# EAGLE design USBSerial (EAGLE 6.3)
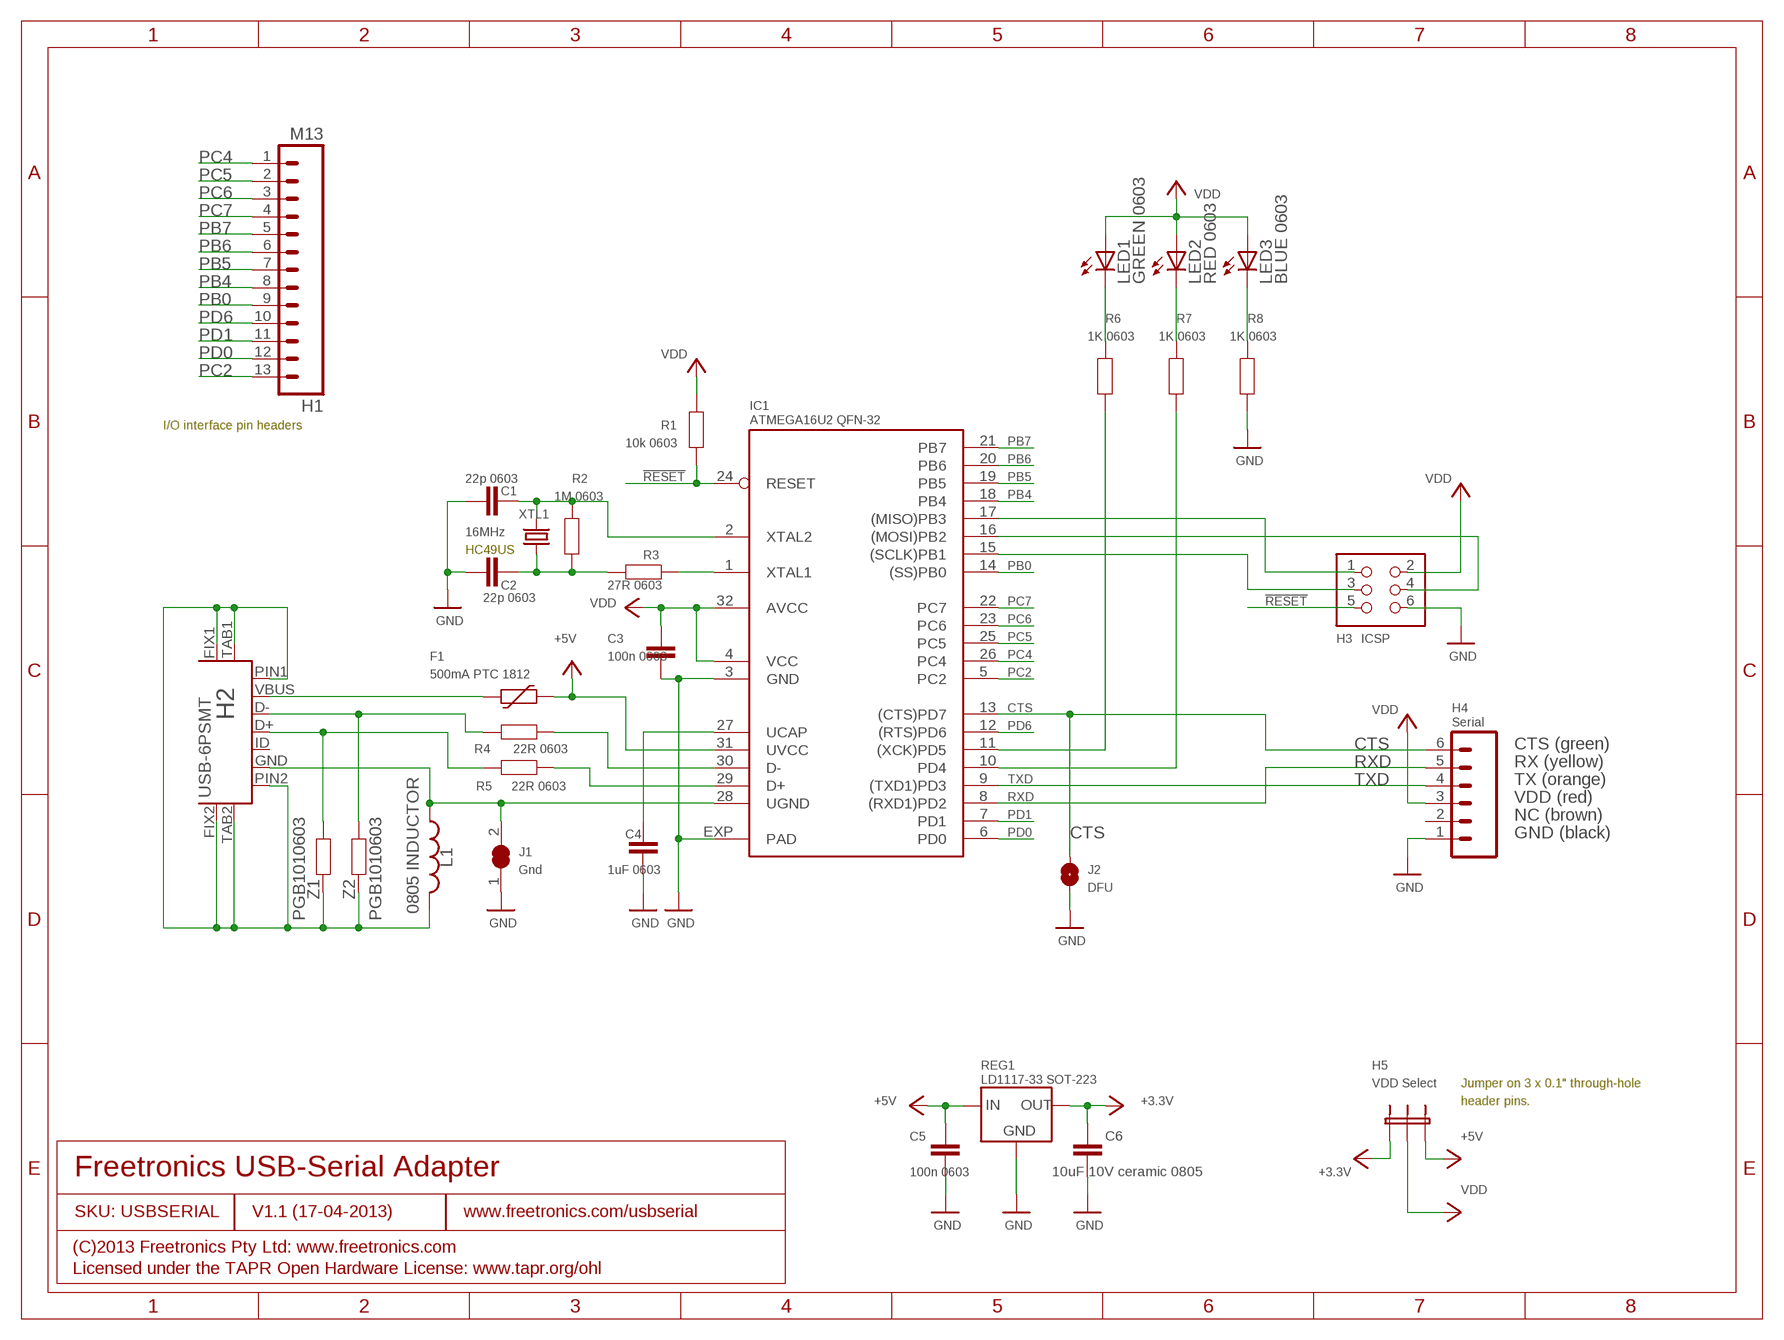
[diagram p0: schematic, sheet 1]

## Parts
C1  22p 0603  CAP0603  [0603]
C2  22p 0603  CAP0603  [0603]
C3  100n 0603  CAP0603  [0603]
C4  1uF 0603  CAP0603  [0603]
C5  100n 0603  CAP0603  [0603]
C6  10uF 10V ceramic 0805  C-EUC0805  [C0805]
F1  500mA PTC 1812  PTC  [1812]
H1  M13  [1X13]
H2  USB-6PSMT  [USB-MICROB-MB05PMXX]
H3  ICSP  HEADER_2X3  [HEADER_2X3]
H4  Serial  M06SIP  [1X06]
H5  VDD Select  JUMPER_SPDT  [JUMPER_SPDT]
IC1  ATMEGA16U2 QFN-32  ATMEL_ATMEGA8U2-MUQFN  [ATMEL_QFN32]
J1  Gnd  SJCN  [SJC]
J2  DFU  SJ  [SJ]
L1  0805 INDUCTOR  INDUCTOR0805-LARGE  [0805-LARGE]
LED1  GREEN 0603  LED0603  [LED-0603]
LED2  RED 0603  LED0603  [LED-0603]
LED3  BLUE 0603  LED0603  [LED-0603]
R1  10k 0603  RESISTOR0603  [0603]
R2  1M 0603  RESISTOR0603  [0603]
R3  27R 0603  RESISTOR0603  [0603]
R4  22R 0603  RESISTOR0603  [0603]
R5  22R 0603  RESISTOR0603  [0603]
R6  1K 0603  RESISTOR0603  [0603]
R7  1K 0603  RESISTOR0603  [0603]
R8  1K 0603  RESISTOR0603  [0603]
REG1  LD1117-33 SOT-223  LD1117-FIXED  [SOT-223]
XTL1  16MHz  CRYSTALHC49US  [HC49US]
Z1  PGB1010603  RESISTOR0603  [0603]
Z2  PGB1010603  RESISTOR0603  [0603]

## Nets
!RESET: H3.5 IC1.24(RESET) R1.1
+3V3: C6.1 H5.1 REG1.2(OUT) REG1.4(OUT) ; supply symbol labelled +3.3V
+5V: C5.1 F1.2 H5.3 IC1.31(UVCC) REG1.3(IN)
CTS: H4.6 IC1.13((CTS)PD7) J2.2
GND: C1.1 C2.1 C3.2 C4.2 C5.2 C6.2 H3.6 H4.1 IC1.3(GND) IC1.EXP(PAD) J1.1 J2.1 R8.1 REG1.1(GND)
MISO: H3.1 IC1.17((MISO)PB3)
MOSI: H3.4 IC1.16((MOSI)PB2)
N$1: H2.GND IC1.28(UGND) J1.2 L1.1
N$2: IC1.1(XTAL1) R3.1
N$3: LED1.C R6.2
N$7: LED2.C R7.2
N$8: H2.FIX1 H2.FIX2 H2.PIN1 H2.PIN2 H2.TAB1 H2.TAB2 L1.2 Z1.2 Z2.2
N$9: LED3.C R8.2
N$16: H2.D+ R5.2 Z1.1
N$17: H2.D- R4.2 Z2.1
N$113: C1.2 IC1.2(XTAL2) R2.2 XTL1.2
N$114: C2.2 R2.1 R3.2 XTL1.1
N$115: F1.1 H2.VBUS
N$117: C4.1 IC1.27(UCAP)
PB0: H1.9 IC1.14((SS)PB0)
PB4: H1.8 IC1.18(PB4)
PB5: H1.7 IC1.19(PB5)
PB6: H1.6 IC1.20(PB6)
PB7: H1.5 IC1.21(PB7)
PC2: H1.13 IC1.5(PC2)
PC4: H1.1 IC1.26(PC4)
PC5: H1.2 IC1.25(PC5)
PC6: H1.3 IC1.23(PC6)
PC7: H1.4 IC1.22(PC7)
PD0: H1.12 IC1.6(PD0)
PD1: H1.11 IC1.7(PD1)
PD6: H1.10 IC1.12((RTS)PD6)
RD+: IC1.29(D+) R5.1
RD-: IC1.30(D-) R4.1
RXD: H4.5 IC1.8((RXD1)PD2)
RXLED: IC1.10(PD4) R7.1
SCK: H3.3 IC1.15((SCLK)PB1)
TXD: H4.4 IC1.9((TXD1)PD3)
TXLED: IC1.11((XCK)PD5) R6.1
VDD: C3.1 H3.2 H4.3 H5.2 IC1.4(VCC) IC1.32(AVCC) LED1.A LED2.A LED3.A R1.2
Unconnected: H2.ID H4.2

## Notes on the sheet
- I/O interface pin headers
- HC49US
- CTS (green)
- RX (yellow)
- TX (orange)
- VDD (red)
- NC (brown)
- GND (black)
- Jumper on 3 x 0.1" through-hole
- header pins.
- Freetronics USB-Serial Adapter
- SKU: USBSERIAL | V1.1 (17-04-2013) | www.freetronics.com/usbserial
- (C)2013 Freetronics Pty Ltd: www.freetronics.com
- Licensed under the TAPR Open Hardware License: www.tapr.org/ohl

## Library data of the parts
C1-C5 = freetronics:CAP: Capacitor Standard 0603 ceramic capacitor, and 0.1" leaded capacitor.
C6 = freetronics-jon:C-EU: CAPACITOR, European symbol
F1 = freetronics-luke:PTC: Polymeric PTC ("Polyfuse")
H1 = freetronics-jon:M13
H2 = freetronics-jon:USB-6P
H3 = freetronics-luke:HEADER_2X3: 6-pin (2x3) 0.1" male through-hole pin header.
H4 = freetronics-master-v1:M06: Header 6 Standard 6-pin 0.1" header. Use with straight break away headers (SKU : PRT-00116), right angle break away headers (PRT-00553), swiss pins (PRT-00743), machine pins (PRT-00117), and female headers (PRT-00115). Molex polarized connector foot print use with SKU : PRT-08094 with associated crimp pins and housings. NOTES ON THE VARIANTS LOCK and LOCK_LONGPADS... This footprint was designed to help hold the alignment of a through-hole component (i.e. 6-pin header) while soldering it into place. You may notice that each hole has been shifted either up or down by 0.005 of an inch from it's more standard position (which is a perfectly straight line). This slight alteration caused the pins (the squares in the middle) to touch the edges of the holes. Because they are alternating, it causes a "brace" to hold the component in place. 0.005 has proven to be the perfect amount of "off-center" position when using our standard breakaway headers. Although looks a little odd when you look at the bare footprint, once you have a header in there, the alteration is very hard to notice. Also, if you push a header all the way into place, it is covered up entirely on the bottom side. This idea of altering the position of holes to aid alignment will be further integrated into the Sparkfun Library for other footprints. It can help hold any component with 3 or more connection pins.
H5 = freetronics-luke:JUMPER_SPDT: 3-pin (SPDT) jumper header, 0.1" pitch through-hole.
IC1 = freetronics-jon:ATMEL_ATMEGA8U2-MU
J1 = freetronics-jon:SJC
J2 = freetronics-luke:SJ: PCB "solder jumper". Note that there should nothing on the BOM corresponding to this "component".
L1 = freetronics-master-v1:INDUCTOR: Inductors Basic Inductor/Choke - 0603 and 1206. Footprints are not proven and vary greatly between part numbers.
LED1-LED3 = freetronics-jon:LED: LEDs Standard schematic elements and footprints for 5mm, 3mm, 1206, and 0603 sized LEDs. 5mm - Spark Fun Electronics SKU : COM-00529 (and others)
R1-R8 Z1 Z2 = freetronics:RESISTOR: Resistor Basic schematic elements and footprints for 0603, 1206, and PTH 1/10th watt (small) resistors.
REG1 = freetronics-luke:LD1117-FIXED: Fixed-voltage LD1117 series LDOs in SOT-223 package. Note that the ground pin is labelled as ground, not as adj, because it's not the adjustable-voltage part.
XTL1 = freetronics-master-v1:CRYSTAL: Crystals Various standard crystals. Proven footprints. Spark Fun Electronics SKU : COM-00534

## Net classes
0 default: width 0.152 mm, drill 0.241 mm, clearance 0.152 mm

## Board
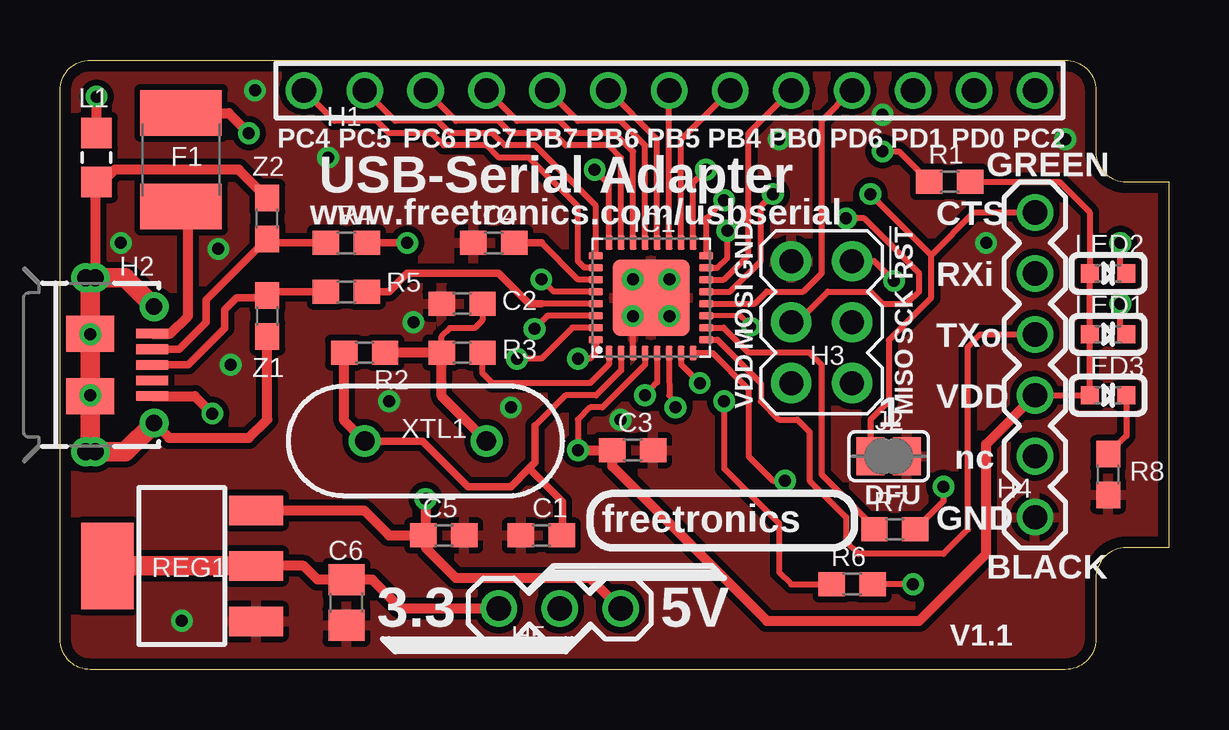
[diagram p1: board, top side]
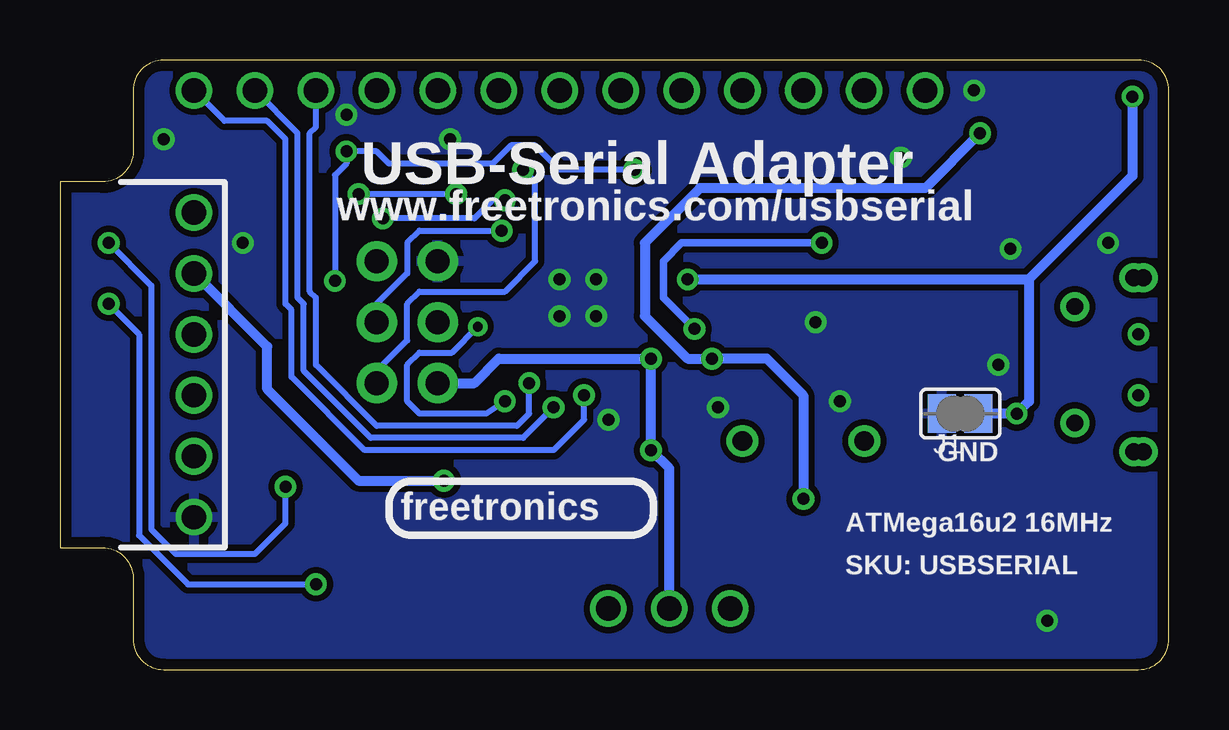
[diagram p2: board, bottom side, seen from below]

Size 46.23 x 25.4 mm. Coordinates in mm from the lower left corner, seen from the top.
Outline: 0,24.13 arc-90 1.27,25.4 41.91,25.4 arc-90 43.18,24.13 43.18,21.59 arc90 44.45,20.32 46.23,20.32 46.23,5.08 44.45,5.08 arc90 43.18,3.81 43.18,1.27 arc-90 41.91,0 1.27,0 arc-90 0,1.27 0,24.13
Copper layers (1*16): Top 0.035mm / dielectric 1.5mm / Bottom 0.035mm
Design rules "default": minimum track width 8mil, minimum drill 15mil, track to track 10mil, track to pad 10mil, pad to pad 10mil, via to via 10mil, smd to smd 8mil, copper to edge 18mil, drill to drill 8mil, minimum pad ring 10mil, minimum via ring 8mil, stop-mask expansion 4mil, vias tented up to drill 25mil, thermal gap 10mil

### Footprints (pad centres in the part's own frame; a part is rotated, then mirrored left to right if it is on the bottom)
0603 = smd 1.1 x 1: 1 -0.85,0; 2 0.85,0
C0805 = smd 1.3 x 1.5: 1 -0.95,0; 2 0.95,0
1812 = smd 1.9 x 3.4: 1 -1.95,0; 2 1.95,0
1X13 = drill 1.016: 1 0,0; 2 2.54,0; 3 5.08,0; 4 7.62,0; 5 10.16,0; 6 12.7,0; 7 15.24,0; 8 17.78,0; 9 20.32,0; 10 22.86,0; 11 25.4,0; 12 27.94,0; 13 30.48,0
USB-MICROB-MB05PMXX = smd 0.4 x 1.35: D+ 0,2.575; D- -0.65,2.575; GND 1.3,2.575; ID 0.65,2.575; VBUS -1.3,2.575 | smd 1.5 x 2: FIX1 -1.3,0; FIX2 1.3,0 | drill 0.7: PIN1 -2.425,2.65; PIN2 2.425,2.65; SLOT1 -3.625,-0.2; SLOT2 3.625,-0.2; TAB1 -3.625,0.2; TAB2 3.625,0.2
HEADER_2X3 = drill 1 pad 1.676: 1 -2.54,-1.27; 2 -2.54,1.27; 3 0,-1.27; 4 0,1.27; 5 2.54,-1.27; 6 2.54,1.27
1X06 = drill 1.016: 1 0,0; 2 2.54,0; 3 5.08,0; 4 7.62,0; 5 10.16,0; 6 12.7,0
JUMPER_SPDT = drill 1.016: 1 -2.54,0; 2 0,0; 3 2.54,0
ATMEL_QFN32 = smd 0.6 x 0.3: 1 -2.3,1.75; 2 -2.3,1.25; 3 -2.3,0.75; 4 -2.3,0.25; 5 -2.3,-0.25; 6 -2.3,-0.75; 7 -2.3,-1.25; 8 -2.3,-1.75; 17 2.3,-1.75; 18 2.3,-1.25; 19 2.3,-0.75; 20 2.3,-0.25; 21 2.3,0.25; 22 2.3,0.75; 23 2.3,1.25; 24 2.3,1.75 | smd 0.3 x 0.6: 9 -1.75,-2.3; 10 -1.25,-2.3; 11 -0.75,-2.3; 12 -0.25,-2.3; 13 0.25,-2.3; 14 0.75,-2.3; 15 1.25,-2.3; 16 1.75,-2.3; 25 1.75,2.3; 26 1.25,2.3; 27 0.75,2.3; 28 0.25,2.3; 29 -0.25,2.3; 30 -0.75,2.3; 31 -1.25,2.3; 32 -1.75,2.3 | smd 3.2 x 3.2: EXP 0,0
SJC = smd 1.168 x 1.6: 1 -0.762,0; 2 0.762,0
SJ = smd 1.168 x 1.6: 1 -0.762,0; 2 0.762,0
0805-LARGE = smd 1.27 x 1.27: 1 -1.016,0; 2 1.016,0
LED-0603 = smd 0.762 x 0.762: A -0.762,0; C 0.762,0
SOT-223 = smd 1.219 x 2.235: 1 -2.311,-3.099; 2 0,-3.099; 3 2.311,-3.099 | smd 3.6 x 2.2: 4 0,3.099
HC49US = drill 0.813: 1 -2.54,0; 2 2.54,0

### Placement (x,y rotation side)
C1  20.07,5.59 0 top
C2  16.76,15.24 0 top
C3  23.88,9.14 0 top
C4  18.08,17.78 180 top
C5  16,5.59 0 top
C6  11.94,2.79 270 top
F1  5.05,21.24 90 top
H1  10.16,24.13 0 top
H2  1.27,12.7 270 top
H3  31.75,14.48 90 top
H4  40.64,6.35 90 top
H5  20.83,2.54 0 top
IC1  24.64,15.49 90 top
J1  8.7,10.67 0 bottom
J2  34.54,8.89 180 top
L1  1.52,21.34 270 top
LED1  43.69,13.97 0 top
LED2  43.69,16.51 0 top
LED3  43.69,11.43 0 top
R1  37.08,20.32 0 top
R2  12.7,13.21 180 top
R3  16.76,13.21 180 top
R4  11.94,17.78 180 top
R5  11.94,15.75 180 top
R6  33.02,3.56 0 top
R7  34.8,5.84 0 top
R8  43.69,8.13 90 top
REG1  5.08,4.32 90 top
XTL1  15.24,9.53 180 top
Z1  8.64,14.73 270 top
Z2  8.64,18.8 90 top

### Tracks (layer width: path | path; a pad name or v marks a point on that pad's centre or on a via)
!RESET  (via drill 0.5)
  Top 0.254: 36.52,20.48 R1.1 34.96,21.59 v34.29,21.59 | IC1.24 22.89,20.23 v22.29,20.83 | H3.5 33.94,17.02 v34.77,16.19
  Top 0.406: 36.35,20.48 36.52,20.48
  Bottom 0.254: v34.77,16.19 34.77,20.61 34.29,21.08 v34.29,21.59 33.02,21.59 32.51,21.08 28.19,21.08 27.43,21.84 26.42,21.84 25.4,20.83 v22.29,20.83
+3V3
  Top 0.406: REG1.2 10.16,4.32 10.73,3.74 C6.1 13.02,3.74 14.22,2.54 H5.1
  Top 0.813: REG1.2 REG1.4
+5V  (via drill 0.5)
  Top 0.254: IC1.31 21.36,14.24 20.07,12.95 v19.05,12.95
  Top 0.406: REG1.3 12.68,6.63 13.72,5.59 C5.1 | v15.24,7.11 15.24,5.68 15.24,5.08 16.51,3.81 22.1,3.81 H5.3 | F1.2 7.04,23.19 v7.87,22.35
  Top 0.61: 15.24,5.68 C5.1
  Bottom 0.406: v15.24,7.11 15.24,11.43 16.76,12.95 v19.05,12.95 20.07,12.95 21.84,14.73 21.84,17.78 19.56,20.07 10.16,20.07 v7.87,22.35
CTS  (via drill 0.5)
  Top 0.254: IC1.13 27.94,15.74 29.21,17.02 29.21,19.3 v29.72,19.81 | 36.32,17.27 36.32,15.49 34.54,13.72 34.54,11.18 33.78,10.41 J2.2 | 36.32,17.27 v33.78,19.81 | 36.32,17.27 38.1,19.05 H4.6
  Bottom 0.254: v29.72,19.81 v33.78,19.81
GND  (via drill 0.5)
  Top 0.254: 23.89,14.2 24.13,14.45 23.97,14.61 | IC1.3 23.89,14.52 23.97,14.61 | 23.97,14.61 23.97,14.73 | 23.97,14.73 23.97,14.83 | v23.88,14.73 23.97,14.73
  Top 0.406: 23.97,14.83 IC1.EXP
  other vias: 8.13,24.13 41.91,22.1 14.73,14.48 5.08,2.03 18.8,10.92 13.72,11.18 25.4,16.26 23.88,16.26 25.4,14.73 29.97,22.1 11.18,21.34 34.29,23.11 23.37,10.41 38.61,17.78 2.54,17.78 6.6,17.53 7.11,12.7
  pour Bottom: 0,25.4 43.18,25.4 43.18,21.59 arc90 44.45,20.32 46.23,20.32 46.23,5.08 44.45,5.08 arc90 43.18,3.81 43.18,0 0,0
  pour Top: 0,25.4 43.18,25.4 43.18,21.59 arc90 44.45,20.32 46.23,20.32 46.23,5.08 44.45,5.08 arc90 43.18,3.81 43.18,0 0,0
MISO  (via drill 0.5)
  Top 0.254: IC1.17 26.39,20.29 v26.92,20.83
  Bottom 0.254: H3.1 33.02,12.45 31.75,13.72 31.75,15.24 31.24,15.75 27.69,15.75 26.42,17.02 26.42,20.32 v26.92,20.83
MOSI  (via drill 0.5)
  Top 0.254: IC1.16 26.94,18.81 v27.69,19.56 | H3.4 30.73,14.48 32,15.75 33.78,15.75 34.29,15.24 35.31,15.24 35.81,15.75 35.81,16.51 33.53,18.8 v32.77,18.8
  Bottom 0.254: v27.69,19.56 28.19,19.56 28.96,18.8 v32.77,18.8
N$1  (via drill 0.5)
  Top 0.254: IC1.28 20.58,15.74 v20.07,16.26
  Top 0.406: H2.GND 5.62,11.4 v6.35,10.67 | L1.1 v1.52,23.88
  Bottom 0.406: v1.52,23.88 1.52,20.57 5.84,16.26 | 5.84,16.26 5.84,11.18 v6.35,10.67 J1.2 | v20.07,16.26 5.84,16.26
N$2
  Top 0.254: IC1.1 22.89,12.73 22.1,11.94 18.03,11.94 17.61,12.36 R3.1
N$3  (via drill 0.5)
  Top 0.254: LED1.C 44.2,14.22 v44.2,15.24 | v35.56,3.56 R6.2
  Bottom 0.254: v44.2,15.24 42.93,13.97 42.93,5.59 40.89,3.56 v35.56,3.56
N$7  (via drill 0.5)
  Top 0.254: LED2.C 44.2,16.76 v44.2,17.78 | 35.9,5.93 R7.2 36.83,7.02 v36.83,7.62
  Bottom 0.254: v44.2,17.78 42.42,16 42.42,5.84 41.4,4.83 38.1,4.83 36.83,6.1 v36.83,7.62
N$8  (via drill 0.5)
  Top 0.406: 1.52,16.38 H2.TAB1 1.47,20.27 L1.2 1.78,20.32 2.29,20.83 7.45,20.83 Z2.2 | H2.PIN2 4.54,9.65 7.87,9.65 8.64,10.41 Z1.2
  Top 0.813: H2.PIN1 2.72,16.32 H2.TAB1 1.27,16.12 H2.FIX1 v1.27,13.97 v1.27,11.43 H2.FIX2 1.27,9.28 H2.TAB2 2.72,9.07 H2.PIN2
N$9
  Top 0.254: LED3.C 44.45,9.74 R8.2
N$16
  Top 0.305: H2.D+ 5.33,12.7 6.86,14.22 6.86,14.99 7.37,15.49 8.55,15.49 Z1.1 8.8,15.75 R5.2
N$17
  Top 0.305: H2.D- 4.97,13.35 6.1,14.48 6.1,15.41 Z2.1 8.8,17.78 R4.2
N$113
  Top 0.254: 20.95,5.77 C1.2 | IC1.2 23.39,12.47 22.35,11.43 21.08,11.43 19.81,10.16
  Top 0.305: XTL1.2 15.11,9.53 17.02,7.62 18.8,7.62 19.56,8.38 | 19.56,8.38 19.81,8.64 19.81,10.16 | 20.95,5.77 20.95,6.99 19.56,8.38
  Top 0.406: 20.95,5.56 20.95,5.77 | XTL1.2 11.85,10.38 R2.2
N$114
  Top 0.254: R3.2 15.91,13.88 16.26,14.22 17.27,14.22 17.61,14.57 C2.2
  Top 0.406: XTL1.1 15.91,11.39 R3.2 R2.1
N$115
  Top 0.406: H2.VBUS 4.6,14 5.33,14.73 5.33,19 F1.1
N$117
  Top 0.254: IC1.27 21.6,16.24 20.07,17.78
  Top 0.305: 20.07,17.78 C4.1
PB0
  Top 0.254: IC1.14 27.67,16.24 28.7,17.27 28.7,22.35 H1.9
PB4
  Top 0.254: IC1.18 25.89,22.08 H1.8
PB5
  Top 0.254: IC1.19 25.39,24.12 H1.7
PB6
  Top 0.254: IC1.20 24.89,22.1 H1.6
PB7
  Top 0.254: IC1.21 24.39,21.84 23.37,22.86 21.59,22.86 H1.5
PC2  (via drill 0.5)
  Top 0.254: IC1.5 24.89,11.97 v24.38,11.43
  Bottom 0.254: v24.38,11.43 24.38,10.41 25.65,9.14 33.53,9.14 36.58,12.19 36.58,14.99 36.83,15.24 36.83,22.1 37.59,22.86 39.37,22.86 H1.13
PC4
  Top 0.254: IC1.26 21.86,16.74 21.59,17.02 21.59,19.3 19.56,21.34 18.29,21.34 17.78,21.84 16,21.84 15.49,22.35 13.72,22.35 13.21,22.86 11.43,22.86 H1.1
PC5
  Top 0.254: IC1.25 22.34,19.32 19.81,21.84 18.54,21.84 18.03,22.35 16.26,22.35 15.75,22.86 13.97,22.86 H1.2
PC6
  Top 0.254: IC1.23 23.39,21.32 22.86,21.84 21.08,21.84 20.57,22.35 18.8,22.35 18.29,22.86 16.51,22.86 H1.3
PC7
  Top 0.254: IC1.22 23.89,21.58 23.11,22.35 21.34,22.35 20.83,22.86 19.05,22.86 H1.4
PD0  (via drill 0.5)
  Top 0.254: IC1.6 25.39,12.43 25.4,11.43 v25.65,10.92
  Bottom 0.254: v25.65,10.92 26.92,9.65 33.27,9.65 36.07,12.45 36.07,15.24 36.32,15.49 36.32,22.35 H1.12
PD1  (via drill 0.5)
  Top 0.254: IC1.7 25.89,12.72 v26.67,11.94
  Bottom 0.254: v26.67,11.94 26.67,10.67 27.18,10.16 33.02,10.16 35.56,12.7 35.56,15.49 35.81,15.75 35.81,22.35 35.56,22.61 H1.11
PD6
  Top 0.254: IC1.12 28.96,15.24 29.46,15.75 30.99,15.75 31.75,16.51 31.75,22.86 H1.10
RD+
  Top 0.254: IC1.29 20.06,15.24
  Top 0.305: R5.1 13.72,15.75 14.48,16.51 18.29,16.51 19.55,15.24 20.06,15.24 20.07,15.24
RD-  (via drill 0.5)
  Top 0.254: IC1.30 20.33,14.74 v19.78,14.19
  Top 0.305: R4.1 v14.48,17.78
  Bottom 0.305: v14.48,17.78 20.32,17.78 21.08,17.02 21.08,15.49 v19.78,14.19
RXD  (via drill 0.5)
  Top 0.254: IC1.8 27.19,13.19 28.7,11.68 28.7,8.89 29.72,7.87 v30.23,7.87
  Bottom 0.406: v30.23,7.87 33.78,7.87 37.59,11.68 37.59,13.46 H4.5
RXLED
  Top 0.254: IC1.10 27.67,14.24 28.7,13.21 31.24,13.21 31.75,12.7 31.75,8.13 34.04,5.84 R7.1
SCK  (via drill 0.5)
  Top 0.254: IC1.15 27.41,16.74 27.81,17.14 v27.81,18.29
  Bottom 0.254: H3.3 33.02,15.24 31.75,16.51 31.75,17.78 31.24,18.29 v27.81,18.29
TXD
  Top 0.254: IC1.9 27.4,13.74 29.21,11.94 29.21,11.18 29.97,10.41 30.73,10.41 31.24,9.91 31.24,7.87 32.77,6.35 32.77,5.33 33.27,4.83 36.83,4.83 37.85,5.84 37.85,13.46 38.35,13.97 H4.4
TXLED  (via drill 0.4, 0.5)
  Top 0.203: IC1.11 28.36,14.74 v28.81,14.29
  Top 0.254: v27.69,11.18 27.69,8.38 29.97,6.1 29.97,4.06 30.48,3.56 R6.1
  Bottom 0.254: v27.69,11.18 28.45,10.67 31.24,10.67 31.75,11.18 31.75,12.7 31.24,13.21 29.89,13.21 v28.81,14.29
VDD  (via drill 0.5)
  Top 0.254: 22.62,9.21 22.62,9.5 C3.1 23.11,9.23 | IC1.32 22.34,13.19 22.1,12.95 v21.59,12.95 | IC1.4 24.39,12.7 22.61,10.92 22.1,10.92 21.59,10.41 v21.59,9.14 | R1.2 41.66,20.32 42.93,19.05 LED2.A LED1.A LED3.A H4.3
  Top 0.406: v21.59,9.14 C3.1 23.03,8.47 29.46,2.03 35.81,2.03 38.61,4.83 38.61,9.4 H4.3
  Bottom 0.406: H5.2 20.83,8.38 v21.59,9.14 v21.59,12.95 27.94,12.95 28.96,11.94 H3.2

### Text on the board
tPlace: PC4 | PC5 | PC6 | PC7 | PB7 | PB6 | PB5 | PB4 | PB0 | PD6 | PD1 | PD0 | PC2 | GREEN | USB-Serial Adapter | www.freetronics.com/usbserial | CTS | GND | !RST | RXi | SCK | MOSI | TXo | VDD | MISO | VDD | 1 | nc | DFU | freetronics | GND | BLACK | 3.3 | 5V | V1.1
bPlace: USB-Serial Adapter | www.freetronics.com/usbserial | GND | ATMega16u2 16MHz | freetronics | SKU: USBSERIAL
tDocu: A | K | A | K | A | K